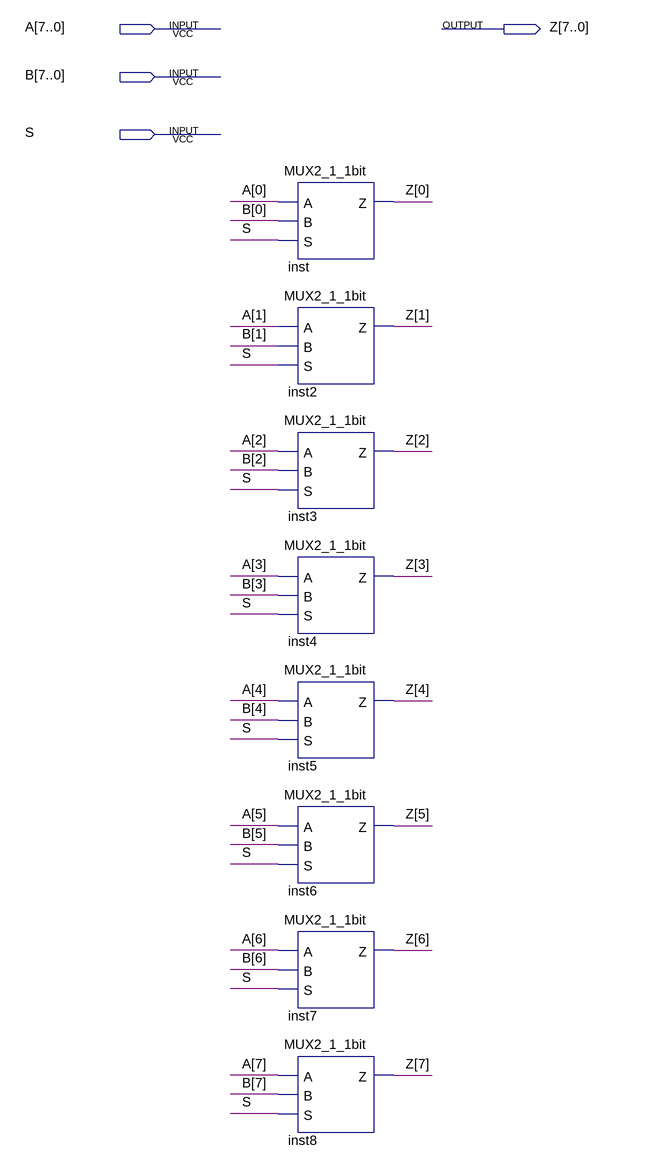
[diagram p0: schematic sheet]
// Quartus schematic MUX2_1_8bits.bdf as structural Verilog: 8 symbols, 4 pins
module MUX2_1_8bits (
  input  [7:0] A,
  input  [7:0] B,
  input  S,
  output [7:0] Z
);

  MUX2_1_1bit inst (.A(A[0]), .B(B[0]), .S(S), .Z(Z[0]));
  MUX2_1_1bit inst2 (.A(A[1]), .B(B[1]), .S(S), .Z(Z[1]));
  MUX2_1_1bit inst3 (.A(A[2]), .B(B[2]), .S(S), .Z(Z[2]));
  MUX2_1_1bit inst4 (.A(A[3]), .B(B[3]), .S(S), .Z(Z[3]));
  MUX2_1_1bit inst5 (.A(A[4]), .B(B[4]), .S(S), .Z(Z[4]));
  MUX2_1_1bit inst6 (.A(A[5]), .B(B[5]), .S(S), .Z(Z[5]));
  MUX2_1_1bit inst7 (.A(A[6]), .B(B[6]), .S(S), .Z(Z[6]));
  MUX2_1_1bit inst8 (.A(A[7]), .B(B[7]), .S(S), .Z(Z[7]));
endmodule
